# EAGLE design project_digisim_01 (EAGLE 9.6.2)

## Sheet 1 of 2
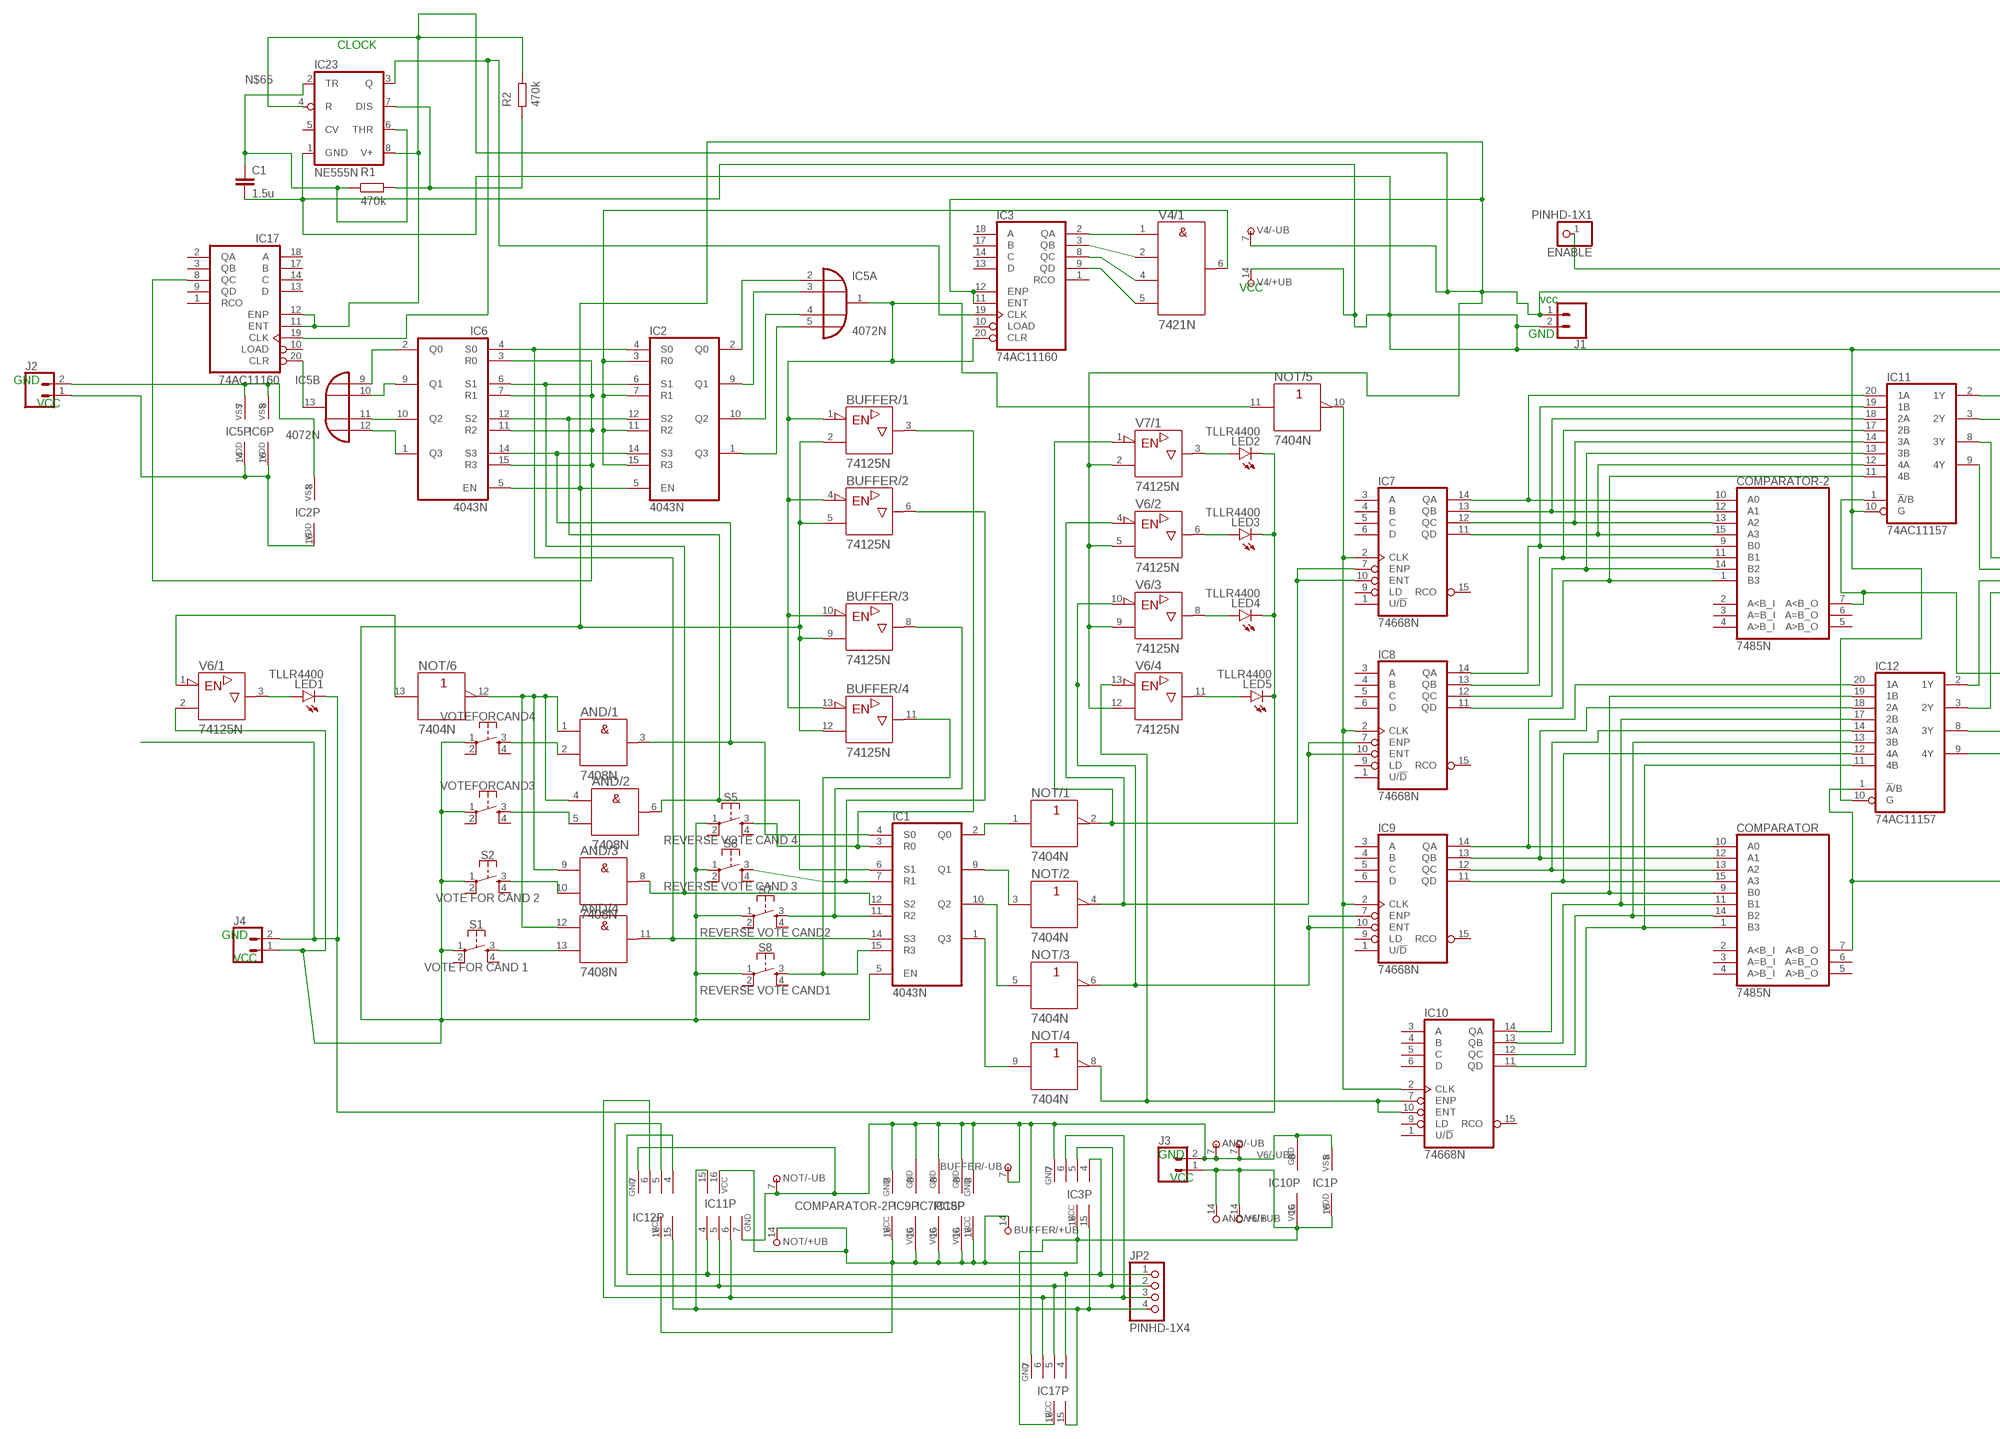
[diagram p0: schematic, sheet 1, part 1 of 2]
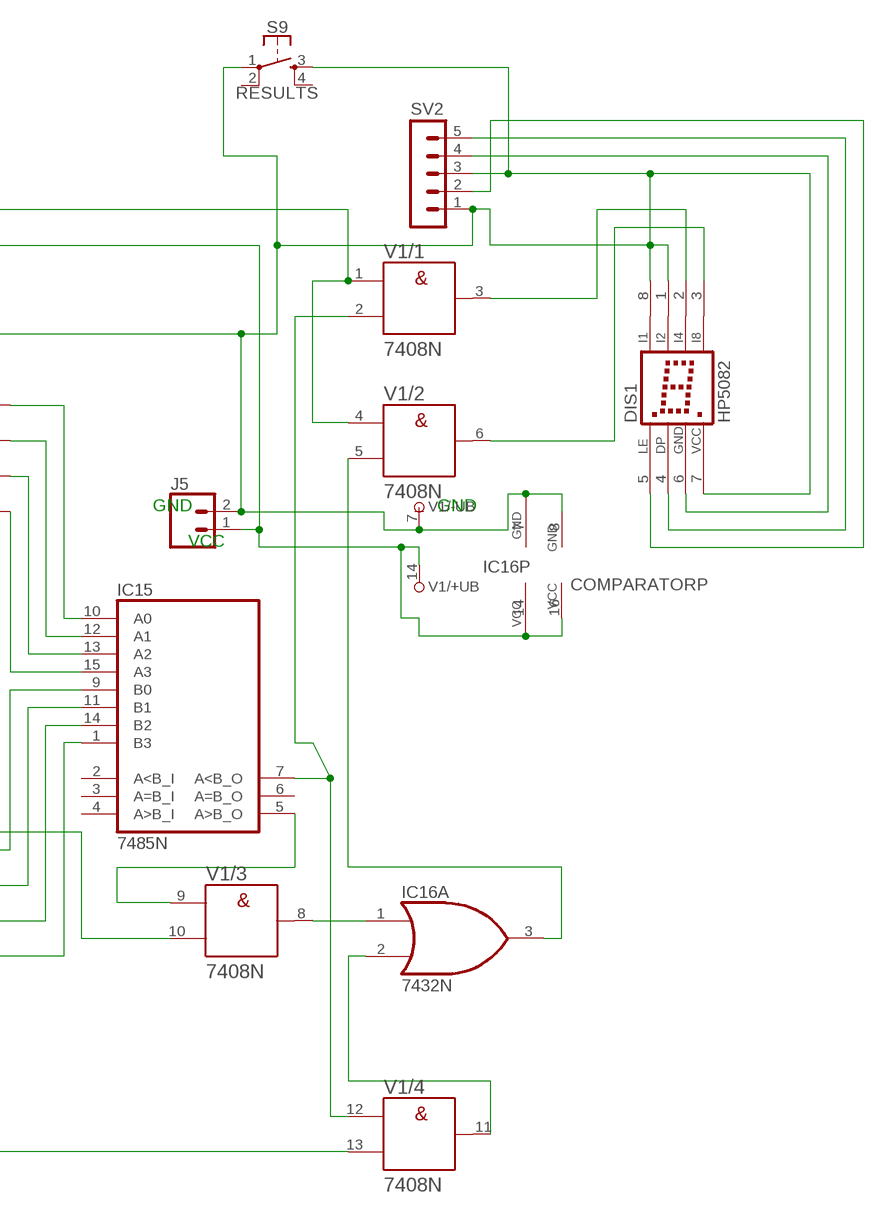
[diagram p1: schematic, sheet 1, part 2 of 2]

### Parts
AND  7408N  [DIL14]
BUFFER  74125N  [DIL14]
C1  1.5u  C2,5-3  [C2.5-3]
COMPARATOR  7485N  [DIL16]
COMPARATOR-2  7485N  [DIL16]
DIS1  HP5082  [HP5082]
ENABLE  PINHD-1X1  [1X01]
IC1  4043N  [DIL16]
IC2  4043N  [DIL16]
IC3  74AC11160  [DIL20]
IC5  4072N  [DIL14]
IC6  4043N  [DIL16]
IC7  74668N  [DIL16]
IC8  74668N  [DIL16]
IC9  74668N  [DIL16]
IC10  74668N  [DIL16]
IC11  74AC11157  [DIL20]
IC12  74AC11157  [DIL20]
IC15  7485N  [DIL16]
IC16  7432N  [DIL14]
IC17  74AC11160  [DIL20]
IC23  NE555N  [DIL08]
J1  CONN_02LOCK  [1X02_LOCK]
J2  CONN_02LOCK  [1X02_LOCK]
J3  CONN_02LOCK  [1X02_LOCK]
J4  CONN_02LOCK  [1X02_LOCK]
J5  CONN_02LOCK  [1X02_LOCK]
JP2  PINHD-1X4  [1X04]
LED1  TLLR4400  [LED3MM]
LED2  TLLR4400  [LED3MM]
LED3  TLLR4400  [LED3MM]
LED4  TLLR4400  [LED3MM]
LED5  TLLR4400  [LED3MM]
NOT  7404N  [DIL14]
R1  470k  R  (no package)
R2  470k  R  (no package)
S1  VOTE FOR CAND 1  MOMENTARY-SWITCH-SPST-2-SMD-4.6X2.8MM  [TACTILE_SWITCH_SMD_4.6X2.8MM]
S2  VOTE FOR CAND 2  MOMENTARY-SWITCH-SPST-2-SMD-4.6X2.8MM  [TACTILE_SWITCH_SMD_4.6X2.8MM]
S5  REVERSE VOTE CAND 4  MOMENTARY-SWITCH-SPST-2-SMD-4.6X2.8MM  [TACTILE_SWITCH_SMD_4.6X2.8MM]
S6  REVERSE VOTE CAND 3  MOMENTARY-SWITCH-SPST-2-SMD-4.6X2.8MM  [TACTILE_SWITCH_SMD_4.6X2.8MM]
S7  REVERSE VOTE CAND2  MOMENTARY-SWITCH-SPST-2-SMD-4.6X2.8MM  [TACTILE_SWITCH_SMD_4.6X2.8MM]
S8  REVERSE VOTE CAND1  MOMENTARY-SWITCH-SPST-2-SMD-4.6X2.8MM  [TACTILE_SWITCH_SMD_4.6X2.8MM]
S9  RESULTS  MOMENTARY-SWITCH-SPST-2-SMD-4.6X2.8MM  [TACTILE_SWITCH_SMD_4.6X2.8MM]
SV2  MA05-1  [MA05-1]
V1  7408N  [DIL14]
V4  7421N  [DIL14]
V6  74125N  [DIL14]
V7  74125N  [DIL14]
VOTEFORCAND3  MOMENTARY-SWITCH-SPST-2-SMD-4.6X2.8MM  [TACTILE_SWITCH_SMD_4.6X2.8MM]
VOTEFORCAND4  MOMENTARY-SWITCH-SPST-2-SMD-4.6X2.8MM  [TACTILE_SWITCH_SMD_4.6X2.8MM]

### Nets
N$1: AND.3(/1:Y) IC1.4(S0) IC2.14(S3) IC6.14(S3)
N$2: IC10.7(ENP) IC10.10(ENT) NOT.8(/4:Y) V6.13(/4:!G)
N$3: IC2.2(Q0) IC5.2(A:I0)
N$4: AND.8(/3:Y) IC1.12(S2) IC2.6(S1) IC6.6(S1)
N$5: DIS1.3(I8) V1.6(/2:Y)
N$6: BUFFER.3(/1:Y) IC1.3(R0) S5.3
N$7: BUFFER.6(/2:Y) IC1.7(R1) S6.3
N$8: BUFFER.11(/4:Y) IC1.15(R3) S8.3
N$9: IC1.2(Q0) NOT.1(/1:A)
N$10: IC1.9(Q1) NOT.3(/2:A)
N$11: NOT.13(/6:A) V6.1(/1:!G)
N$12: IC1.10(Q2) NOT.5(/3:A)
N$13: LED2.A V7.3(/1:Y)
N$14: IC1.1(Q3) NOT.9(/4:A)
N$15: LED3.A V6.6(/2:Y)
N$16: IC7.7(ENP) IC7.10(ENT) NOT.2(/1:Y) V7.1(/1:!G)
N$17: IC16.1(A:I0) V1.8(/3:Y)
N$18: IC2.8(VSS) IC5.7(P:VSS) IC6.8(VSS) J2.2
N$19: COMPARATOR-2.10(A0) IC7.14(QA) IC11.20(1A)
N$20: COMPARATOR-2.12(A1) IC7.13(QB) IC11.18(2A)
N$21: LED4.A V6.8(/3:Y)
N$22: COMPARATOR-2.13(A2) IC7.12(QC) IC11.14(3A)
N$23: COMPARATOR-2.15(A3) IC7.11(QD) IC11.12(4A)
N$24: COMPARATOR-2.9(B0) IC8.14(QA) IC11.19(1B)
N$25: COMPARATOR-2.11(B1) IC8.13(QB) IC11.17(2B)
N$26: COMPARATOR-2.14(B2) IC8.12(QC) IC11.13(3B)
N$27: COMPARATOR-2.1(B3) IC8.11(QD) IC11.11(4B)
N$28: COMPARATOR.10(A0) IC9.14(QA) IC12.20(1A)
N$29: COMPARATOR.12(A1) IC9.13(QB) IC12.18(2A)
N$30: COMPARATOR.13(A2) IC9.12(QC) IC12.14(3A)
N$31: COMPARATOR.15(A3) IC9.11(QD) IC12.12(4A)
N$32: COMPARATOR.9(B0) IC10.14(QA) IC12.19(1B)
N$33: COMPARATOR.11(B1) IC10.13(QB) IC12.17(2B)
N$34: COMPARATOR.14(B2) IC10.12(QC) IC12.13(3B)
N$35: COMPARATOR.1(B3) IC10.11(QD) IC12.11(4B)
N$36: IC11.2(1Y) IC15.10(A0)
N$37: IC11.3(2Y) IC15.12(A1)
N$38: IC11.8(3Y) IC15.13(A2)
N$39: IC11.9(4Y) IC15.15(A3)
N$40: IC12.2(1Y) IC15.9(B0)
N$41: IC12.3(2Y) IC15.11(B1)
N$42: IC12.8(3Y) IC15.14(B2)
N$43: IC12.9(4Y) IC15.1(B3)
N$44: COMPARATOR-2.7(A<B_O) IC11.1(!A!/B) V1.10(/3:B)
N$45: COMPARATOR.7(A<B_O) IC12.1(!A!/B) V1.13(/4:B)
N$46: AND.11(/4:Y) IC1.14(S3) IC2.4(S0) IC6.4(S0)
N$47: IC15.5(A>B_O) V1.9(/3:A)
N$48: ENABLE.1 V1.1(/1:A) V1.4(/2:A)
N$49: IC2.16(VDD) IC5.14(P:VDD) IC6.16(VDD) J2.1
N$50: IC16.2(A:I1) V1.11(/4:Y)
N$51: IC3.19(CLK) IC17.19(CLK) IC23.3(Q)
N$52: IC2.9(Q1) IC5.3(A:I1)
N$53: IC2.10(Q2) IC5.4(A:I2)
N$54: IC2.1(Q3) IC5.5(A:I3)
N$55: BUFFER.8(/3:Y) IC1.11(R2) S7.3
N$56: LED5.A V6.11(/4:Y)
N$57: IC16.3(A:O) V1.5(/2:B)
N$58: IC8.7(ENP) IC8.10(ENT) NOT.4(/2:Y) V6.4(/2:!G)
N$59: DIS1.2(I4) V1.3(/1:Y)
N$60: IC7.2(CLK) IC8.2(CLK) IC9.2(CLK) IC10.2(CLK) NOT.10(/5:Y)
N$61: J4.2 LED1.K(C) LED2.K(C) LED3.K(C) LED4.K(C) LED5.K(C)
N$62: IC15.7(A<B_O) V1.2(/1:B) V1.12(/4:A)
N$63: AND.6(/2:Y) IC1.6(S1) IC2.12(S2) IC6.12(S2)
N$64: LED1.A V6.3(/1:Y)
N$65: C1.1 IC23.2(TR) IC23.6(THR) R1.1
N$66: AND.2(/1:B) VOTEFORCAND4.3
N$67: AND.5(/2:B) VOTEFORCAND3.3
N$68: AND.10(/3:B) S2.3
N$69: AND.13(/4:B) S1.3
N$70: AND.1(/1:A) AND.4(/2:A) AND.9(/3:A) AND.12(/4:A) NOT.12(/6:Y)
N$71: IC3.2(QA) V4.1(/1:A)
N$72: IC3.3(QB) V4.2(/1:B)
N$73: IC3.8(QC) V4.4(/1:C)
N$74: IC3.9(QD) V4.5(/1:D)
N$75: IC2.3(R0) IC2.7(R1) IC2.11(R2) IC2.15(R3) V4.6(/1:Y)
N$76: IC23.7(DIS) R1.2 R2.1
N$77: IC5.13(B:O) IC17.20(CLR)
N$78: IC5.9(B:I0) IC6.2(Q0)
N$79: IC5.10(B:I1) IC6.9(Q1)
N$80: IC5.11(B:I2) IC6.10(Q2)
N$81: IC5.12(B:I3) IC6.1(Q3)
N$82: IC6.3(R0) IC6.7(R1) IC6.11(R2) IC6.15(R3) IC17.8(QC)
N$83: BUFFER.2(/1:A) BUFFER.5(/2:A) BUFFER.9(/3:A) BUFFER.12(/4:A) COMPARATOR.16(VCC) IC1.5(EN) IC2.5(EN) IC3.11(ENT) IC3.12(ENP) IC6.5(EN) IC16.14(P:VCC) IC17.11(ENT) IC17.12(ENP) IC23.4(R) IC23.8(V+) J1.1 J4.1 J5.1 R2.2 S1.1 S2.1 S5.1 S6.1 S7.1 S8.1 V1.14(/+UB:+UB) V4.7(/-UB:-UB) V6.2(/1:A) V6.5(/2:A) V6.9(/3:A) V6.12(/4:A) V7.2(/1:A) VOTEFORCAND3.1 VOTEFORCAND4.1
N$84: IC9.7(ENP) IC9.10(ENT) NOT.6(/3:Y) V6.10(/3:!G)
N$85: C1.2 COMPARATOR.8(GND) DIS1.1(I2) DIS1.7(VCC) DIS1.8(I1) IC11.10(G) IC12.10(G) IC16.7(P:GND) IC23.1(GND) J1.2 J5.2 S9.1 S9.3 SV2.1 SV2.3 V1.7(/-UB:-UB) V4.14(/+UB:+UB)
N$86: DIS1.6(GND) SV2.4
N$87: DIS1.4(DP) SV2.5
N$88: BUFFER.1(/1:!G) BUFFER.4(/2:!G) BUFFER.10(/3:!G) BUFFER.13(/4:!G) IC3.20(CLR) IC5.1(A:O) NOT.11(/5:A)
N$89: DIS1.5(LE) SV2.2
N$90: AND.7(/-UB:-UB) BUFFER.7(/-UB:-UB) COMPARATOR-2.8(GND) IC1.8(VSS) IC3.7(GND) IC7.8(GND) IC8.8(GND) IC9.8(GND) IC10.8(GND) IC11.7(GND) IC12.7(GND) IC15.8(GND) IC17.7(GND) J3.2 NOT.7(/-UB:-UB) V6.7(/-UB:-UB)
N$91: AND.14(/+UB:+UB) BUFFER.14(/+UB:+UB) COMPARATOR-2.16(VCC) IC1.16(VDD) IC3.16(VCC) IC7.16(VCC) IC8.16(VCC) IC9.16(VCC) IC10.16(VCC) IC11.16(VCC) IC12.16(VCC) IC15.16(VCC) IC17.16(VCC) J3.1 NOT.14(/+UB:+UB) V6.14(/+UB:+UB)
N$92: IC3.4(GND) IC11.4(GND) IC12.4(GND) IC17.4(GND) JP2.1
N$93: IC3.5(GND) IC11.5(GND) IC12.5(GND) IC17.5(GND) JP2.2
N$95: IC3.15(VCC) IC11.15(VCC) IC12.15(VCC) IC17.15(VCC) JP2.4
N$99: IC3.6(GND) IC11.6(GND) IC12.6(GND) IC17.6(GND) JP2.3
Unconnected: COMPARATOR-2.2(A<B_I) COMPARATOR-2.3(A=B_I) COMPARATOR-2.4(A>B_I) COMPARATOR-2.5(A>B_O) COMPARATOR-2.6(A=B_O) COMPARATOR.2(A<B_I) COMPARATOR.3(A=B_I) COMPARATOR.4(A>B_I) COMPARATOR.5(A>B_O) COMPARATOR.6(A=B_O) IC3.1(RCO) IC3.10(LOAD) IC3.13(D) IC3.14(C) IC3.17(B) IC3.18(A) IC7.1(U/!D) IC7.3(A) IC7.4(B) IC7.5(C) IC7.6(D) IC7.9(LD) IC7.15(RCO) IC8.1(U/!D) IC8.3(A) IC8.4(B) IC8.5(C) IC8.6(D) IC8.9(LD) IC8.15(RCO) IC9.1(U/!D) IC9.3(A) IC9.4(B) IC9.5(C) IC9.6(D) IC9.9(LD) IC9.15(RCO) IC10.1(U/!D) IC10.3(A) IC10.4(B) IC10.5(C) IC10.6(D) IC10.9(LD) IC10.15(RCO) IC15.2(A<B_I) IC15.3(A=B_I) IC15.4(A>B_I) IC15.6(A=B_O) IC16.4(B:I0) IC16.5(B:I1) IC16.6(B:O) IC16.8(C:O) IC16.9(C:I0) IC16.10(C:I1) IC16.11(D:O) IC16.12(D:I0) IC16.13(D:I1) IC17.1(RCO) IC17.2(QA) IC17.3(QB) IC17.9(QD) IC17.10(LOAD) IC17.13(D) IC17.14(C) IC17.17(B) IC17.18(A) IC23.5(CV) S1.2 S1.4 S2.2 S2.4 S5.2 S5.4 S6.2 S6.4 S7.2 S7.4 S8.2 S8.4 S9.2 S9.4 V4.8(/2:Y) V4.9(/2:A) V4.10(/2:B) V4.12(/2:C) V4.13(/2:D) V7.4(/2:!G) V7.5(/2:A) V7.6(/2:Y) V7.8(/3:Y) V7.9(/3:A) V7.10(/3:!G) V7.11(/4:Y) V7.12(/4:A) V7.13(/4:!G) VOTEFORCAND3.2 VOTEFORCAND3.4 VOTEFORCAND4.2 VOTEFORCAND4.4

### Notes on the sheet
- CLOCK
- VCC
- vcc
- GND
- GND
- VCC
- GND | GND
- VCC
- GND
- VCC
- GND
- VCC

## Sheet 2 of 2

## Power pins joined to a net without a drawn wire
+UB: V7.14(/+UB:+UB)
-UB: V7.7(/-UB:-UB)

## Library data of the parts
AND V1 = 74ttl-din:74*08: Quad 2-input AND gate
BUFFER V6 V7 = 74ttl-din:74*125: Quad bus BUFFER, 3-state
C1 = capacitor-wima:C: CAPACITOR naming: grid - package width
COMPARATOR COMPARATOR-2 IC15 = 74xx-eu:74*85: 4-bit magnitude COMPARATOR
DIS1 = display-hp:HP5082: LED DISPLAY 1-character dot matrix, 2 decimal points; OC_FARNELL: unknown; OC_NEWARK: unknown
ENABLE = Connector:PINHD-1X1: PIN HEADER; CATEGORY: CONNECTOR; SUB-CATEGORY: PIN-HEADER
IC1 IC2 IC6 = 40xx:4043: Quad 3-state NOR R/S LATCH
IC3 IC17 = 74ac-logic:74AC11160: Synchronous 4-bit decade Counter
IC5 = 40xx:4072: Dual 4-input OR
IC7-IC10 = 74xx-us:74*668: 4-bit synchronous decade COUNTER, preset
IC11 IC12 = 74ac-logic:74AC11157: Quadruple 2 to 1 line DATA SELECTOR/MULTIPLEXER
IC16 = 74xx-us:74*32: Quad 2-input OR gate
IC23 = linear:*555: TIMER
J1-J5 = SparkFun-Connectors:CONN_02: Multi connection point. Often used as Generic Header-pin footprint for 0.1 inch spaced/style header connections On any of the 0.1 inch spaced packages, you can populate with these: Break Away Headers - Straight <https://www.sparkfun.com/products/116> (PRT-00116) Break Away Male Headers - Right Angle <https://www.sparkfun.com/products/553> (PRT-00553) Female Headers <https://www.sparkfun.com/products/115> (PRT-00115) Break Away Headers - Machine Pin <https://www.sparkfun.com/products/117> (PRT-00117) Break Away Female Headers - Swiss Machine Pin <https://www.sparkfun.com/products/743> (PRT-00743) For SCREWTERMINALS and SPRING TERMINALS visit here: Screw Terimnals on SparkFun.com <https://www.sparkfun.com/search/results?term=Screw+Terminals> (5mm/3.5mm/2.54mm spacing) This device is also useful as a general connection point to wire up your design to another part of your project. Our various solder wires solder well into these plated through hole pads. Hook-Up Wire - Assortment (Stranded, 22 AWG) <https://www.sparkfun.com/products/11375> (PRT-11375) Hook-Up Wire - Assortment (Solid Core, 22 AWG) <https://www.sparkfun.com/products/11367> (PRT-11367) View the entire wire category on our website here <https://www.sparkfun.com/categories/141> Special notes: Molex polarized connector foot print use with: PRT-08233 with associated crimp pins and housings. 2.54_SCREWTERM for use with PRT-10571. 3.5mm Screw Terminal footprints for PRT-08084 5mm Screw Terminal footprints for use with PRT-08432
JP2 = Connector:PINHD-1X4: PIN HEADER; CATEGORY: CONNECTOR; SUB-CATEGORY: PIN-HEADER
LED1-LED5 = led:TLLR4400: Low Current (2mA) LED 3 mm Tinted Diffused Package color RED Source: Data sheet <http://www.farnell.com/datasheets/391100.pdf>; MF: VISHAY SEMICONDUCTOR; OC_FARNELL: 1612437
NOT = 74ttl-din:74*04: Hex INVERTER
R1 R2 = ngspice-simulation:R: RESISTOR
S1 S2 S5-S9 VOTEFORCAND3 VOTEFORCAND4 = SparkFun-Switches:MOMENTARY-SWITCH-SPST-2: Momentary Switch (Pushbutton) - SPST - Two Circuits Normally-open (NO) SPST momentary switches (buttons, pushbuttons). Schematic symbol includes two switch circuits. Variants SMD-4.6MMX2.8MM - 4.60mm x 2.80mm Tactile Momentary Button Switch - Used on SparkFun SAMD21 Mini Breakout <https://www.sparkfun.com/products/13664> SMD-5.2MM - Mini Pushbutton Switch - SMD <https://www.sparkfun.com/products/8720> - Used on Arduino Pro Mini <https://www.sparkfun.com/products/11114>; PROD_ID: SWCH-13065
SV2 = con-lstb:MA05-1: PIN HEADER; OC_FARNELL: unknown; OC_NEWARK: unknown
V4 = 74ttl-din:74*21: Dual 4-input AND gate

## Board
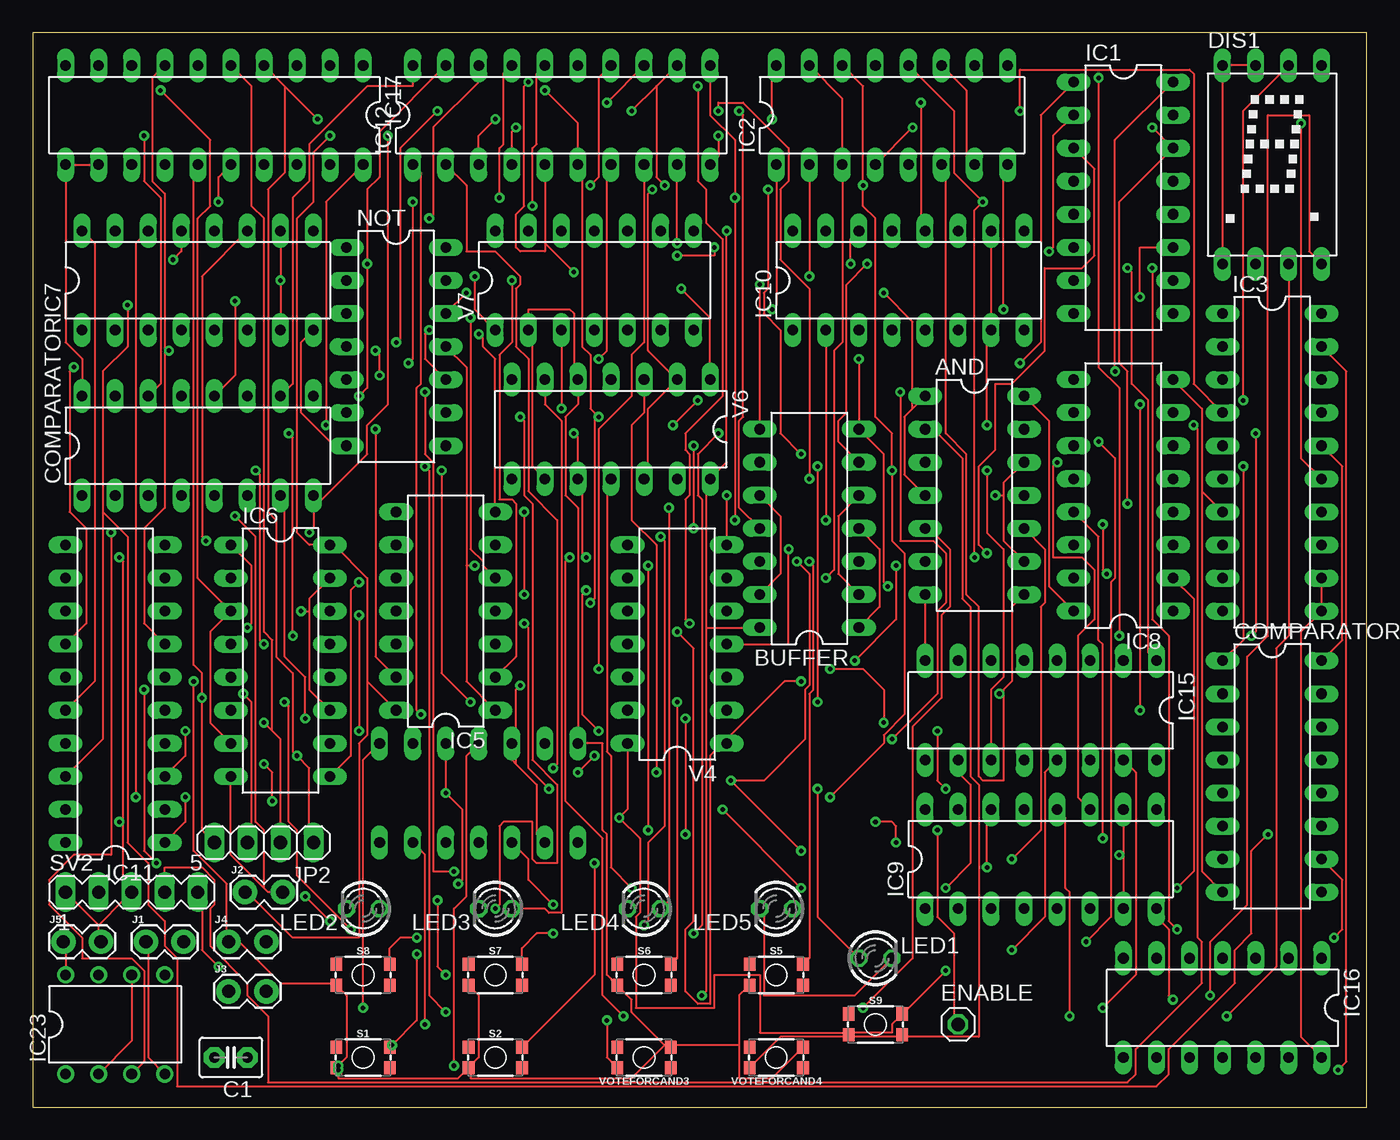
[diagram p2: board, top side]
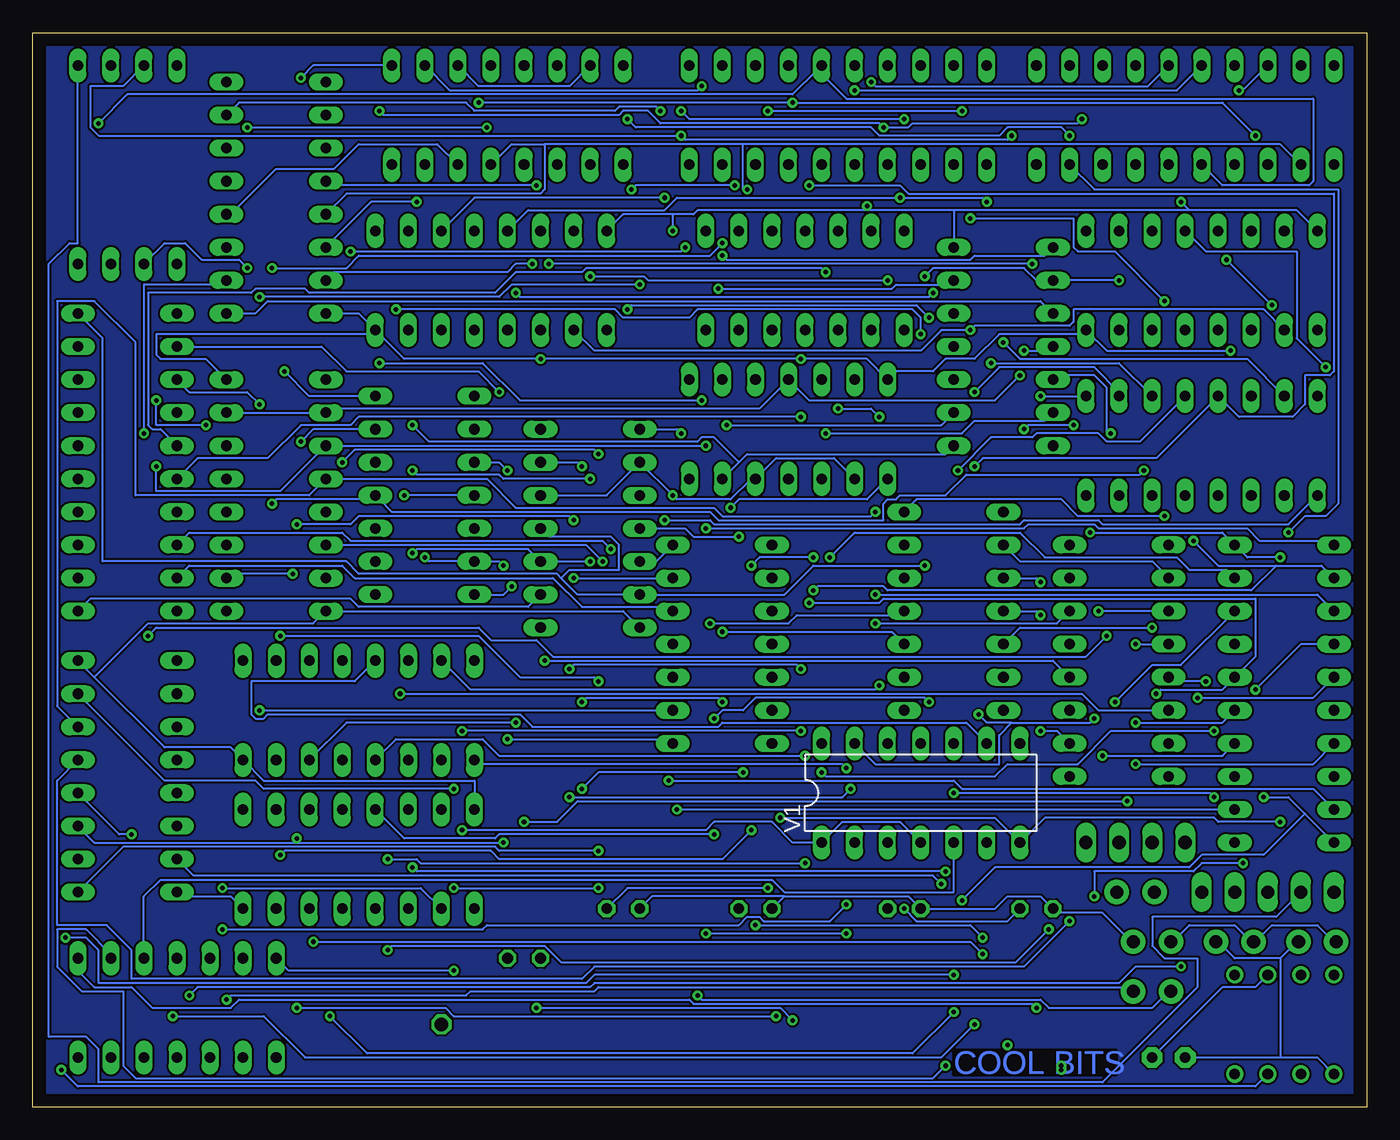
[diagram p3: board, bottom side, seen from below]

Size 102.54 x 82.54 mm. Coordinates in mm from the lower left corner, seen from the top.
Outline: 0,0 102.54,0 102.54,82.54 0,82.54 0,0
Copper layers (1*16): Top 0.035mm / dielectric 1.5mm / Bottom 0.035mm
Design rules "default": minimum track width 6mil, minimum drill 0.35mm, track to track 6mil, track to pad 6mil, pad to pad 6mil, via to via 6mil, smd to smd 6mil, copper to edge 40mil, drill to drill 6mil, minimum pad ring 10mil, minimum via ring 8mil, stop-mask expansion 4mil, vias tented up to drill 0mil, thermal gap 10mil

### Footprints (pad centres in the part's own frame; a part is rotated, then mirrored left to right if it is on the bottom)
DIL14 = drill 0.813 long: 1 -7.62,-3.81; 2 -5.08,-3.81; 3 -2.54,-3.81; 4 0,-3.81; 5 2.54,-3.81; 6 5.08,-3.81; 7 7.62,-3.81; 8 7.62,3.81; 9 5.08,3.81; 10 2.54,3.81; 11 0,3.81; 12 -2.54,3.81; 13 -5.08,3.81; 14 -7.62,3.81
C2.5-3 = drill 0.813 pad 1.6 octagon: 1 -1.27,0; 2 1.27,0
DIL16 = drill 0.813 long: 1 -8.89,-3.81; 2 -6.35,-3.81; 3 -3.81,-3.81; 4 -1.27,-3.81; 5 1.27,-3.81; 6 3.81,-3.81; 7 6.35,-3.81; 8 8.89,-3.81; 9 8.89,3.81; 10 6.35,3.81; 11 3.81,3.81; 12 1.27,3.81; 13 -1.27,3.81; 14 -3.81,3.81; 15 -6.35,3.81; 16 -8.89,3.81
HP5082 = drill 0.813 long: 1 -3.81,-7.62; 2 -1.27,-7.62; 3 1.27,-7.62; 4 3.81,-7.62; 5 3.81,7.62; 6 1.27,7.62; 7 -1.27,7.62; 8 -3.81,7.62
1X01 = drill 1.016 octagon: 1 0,0
DIL20 = drill 0.813 long: 1 -11.43,-3.81; 2 -8.89,-3.81; 3 -6.35,-3.81; 4 -3.81,-3.81; 5 -1.27,-3.81; 6 1.27,-3.81; 7 3.81,-3.81; 8 6.35,-3.81; 9 8.89,-3.81; 10 11.43,-3.81; 11 11.43,3.81; 12 8.89,3.81; 13 6.35,3.81; 14 3.81,3.81; 15 1.27,3.81; 16 -1.27,3.81; 17 -3.81,3.81; 18 -6.35,3.81; 19 -8.89,3.81; 20 -11.43,3.81
DIL08 = drill 0.813 pad 1.27: 1 -3.81,-3.81; 2 -1.27,-3.81; 3 1.27,-3.81; 4 3.81,-3.81; 5 3.81,3.81; 6 1.27,3.81; 7 -1.27,3.81; 8 -3.81,3.81
1X02_LOCK = drill 1.016 pad 1.88: 1 -0.178,0; 2 2.718,0
1X04 = drill 1.016 long: 1 -3.81,0; 2 -1.27,0; 3 1.27,0; 4 3.81,0
LED3MM = drill 0.813 octagon: A -1.27,0; K 1.27,0
TACTILE_SWITCH_SMD_4.6X2.8MM = smd 0.9 x 1: 1 -2.05,-0.8; 2 2.05,-0.8; 3 2.05,0.8; 4 -2.05,0.8
MA05-1 = drill 1.016 long: 1 -5.08,0; 2 -2.54,0; 3 0,0; 4 2.54,0; 5 5.08,0

### Placement (x,y rotation side)
AND  72.39,46.99 270 top
BUFFER  59.69,44.45 90 top
C1  15.24,3.81 180 top
COMPARATOR  12.7,50.8 0 top
COMPARATOR-2  95.25,25.4 270 top
DIS1  95.25,72.39 0 top
ENABLE  71.12,6.35 0 top
IC1  83.82,69.85 270 top
IC2  66.04,76.2 0 top
IC3  95.25,49.53 270 top
IC5  31.75,38.1 90 top
IC6  19.05,34.29 270 top
IC7  12.7,63.5 0 top
IC8  83.82,46.99 90 top
IC9  77.47,19.05 0 top
IC10  67.31,63.5 0 top
IC11  6.35,31.75 90 top
IC12  40.64,76.2 0 top
IC15  77.47,30.48 180 top
IC16  91.44,7.62 180 top
IC17  13.97,76.2 180 top
IC23  6.35,6.35 0 top
J1  8.89,12.7 0 top
J2  16.51,16.51 0 top
J3  15.24,8.89 0 top
J4  15.24,12.7 0 top
J5  2.54,12.7 0 top
JP2  17.78,20.32 180 top
LED1  64.77,11.43 0 top
LED2  25.4,15.24 180 top
LED3  35.56,15.24 180 top
LED4  46.99,15.24 180 top
LED5  57.15,15.24 180 top
NOT  27.94,58.42 270 top
S1  25.4,3.81 0 top
S2  35.56,3.81 0 top
S5  57.15,10.16 0 top
S6  46.99,10.16 0 top
S7  35.56,10.16 0 top
S8  25.4,10.16 0 top
S9  64.77,6.35 0 top
SV2  7.62,16.51 0 top
V1  34.29,24.13 0 bottom
V4  49.53,35.56 90 top
V6  44.45,52.07 180 top
V7  43.18,63.5 0 top
VOTEFORCAND3  46.99,3.81 180 top
VOTEFORCAND4  57.15,3.81 180 top

### Tracks (layer width: path | path; a pad name or v marks a point on that pad's centre or on a via)
GND
  pour Bottom: 0,82.55 102.87,82.55 102.87,0 0,0
N$1  (via drill 0.35)
  Top 0.152: v37.78,37.15 38.1,36.83 38.1,26.04 v39.69,24.45 | v61.28,23.81 65.41,27.94 65.41,28.57 66.99,30.16 66.99,42.55 66.04,43.5 v66.04,48.9 66.04,51.75 64.77,53.02 64.77,68.26 63.82,69.22 v63.82,70.8 63.82,78.42 IC2.14
  Bottom 0.152: IC6.14 23.81,37.15 v37.78,37.15 | v39.69,24.45 40.32,23.81 v61.28,23.81 | v66.04,48.9 66.67,49.53 AND.3 | IC1.4 79.69,70.8 v63.82,70.8
N$2  (via drill 0.35)
  Top 0.152: IC10.10 IC10.7 73.34,59.37 v73.34,52.39
  Bottom 0.152: NOT.8 32.38,50.16 47.62,50.16 48.26,49.53 | V6.13 48.26,49.53 | v73.34,52.39 72.07,51.12 51.44,51.12 51.12,51.44 50.16,51.44 48.26,49.53
N$3  (via drill 0.35)
  Top 0.152: IC5.2 37.15,34.61 37.15,46.35 36.83,46.67 35.88,46.67 35.88,57.78 36.83,58.74 v36.83,63.5 | IC2.2 v59.69,63.82
  Bottom 0.152: v36.83,63.5 55.24,63.5 55.56,63.82 v59.69,63.82
N$4  (via drill 0.35)
  Top 0.152: 74.61,32.07 75.25,32.7 75.25,38.42 AND.8 | 74.61,32.07 v74.3,31.75 | IC2.6 70.17,72.07 70.17,51.75 71.75,50.16 71.75,39.37 72.71,38.42 72.71,25.4 73.03,25.08 74.61,25.08 74.61,32.07
  Bottom 0.152: IC2.6 71.44,73.98 77.47,73.98 79.38,72.07 83.82,72.07 87.31,68.58 IC1.12 | IC6.6 20.64,30.48 21.91,31.75 v74.3,31.75
N$5  (via drill 0.35)
  Top 0.152: V1.6 30.16,19.37 v30.16,6.35 | v91.76,6.99 95.57,10.79 95.57,35.24 96.52,36.2 DIS1.3
  Bottom 0.152: v30.16,6.35 32.7,3.81 81.6,3.81 84.77,6.99 v91.76,6.99
N$6  (via drill 0.35)
  Top 0.152: v59.69,41.91 60.01,41.59 60.01,32.07 59.69,31.75 59.69,11.43 59.37,11.11 S5.3 | IC1.3 81.6,72.07 81.6,65.41 80.64,64.45 77.79,64.45 77.79,58.1 75.25,55.56 73.98,55.56 73.98,50.48 72.71,49.21 72.71,43.18 v73.34,42.55
  Bottom 0.152: v59.69,41.91 BUFFER.3 64.45,42.86 73.03,42.86 v73.34,42.55
N$7  (via drill 0.35)
  Top 0.152: v49.53,31.11 49.53,11.43 49.21,11.11 S6.3 | v60.33,49.21 v60.33,31.11 | v64.14,64.77 62.55,63.18 62.55,53.34 61.91,52.7 61.91,51.12 BUFFER.6
  Bottom 0.152: v49.53,31.11 49.85,31.43 60.01,31.43 v60.33,31.11 | v60.33,49.21 60.64,49.53 BUFFER.6 | IC1.7 79.38,64.14 66.04,64.14 65.41,64.77 v64.14,64.77
N$8  (via drill 0.35)
  Top 0.152: v29.53,13.02 28.26,13.02 27.45,12.21 S8.3 | v46.99,13.97 47.31,14.29 47.31,20.32 48.58,21.59 48.58,43.5 v48.26,43.81 | v54.29,76.52 54.61,76.2 54.61,53.02 54.29,52.7 54.29,46.04 BUFFER.11
  Bottom 0.152: v29.53,13.02 30.48,13.97 v46.99,13.97 | v48.26,43.81 51.75,43.81 52.39,44.45 BUFFER.11 | IC1.15 86.68,77.15 69.22,77.15 68.58,76.52 57.78,76.52 57.47,76.83 54.61,76.83 v54.29,76.52
N$9  (via drill 0.35)
  Top 0.152: v49.53,65.41 52.39,65.41 v52.39,66.04 | v78.11,65.72 78.42,66.04 78.42,74.61 IC1.2
  Bottom 0.152: NOT.1 24.77,65.41 30.16,65.41 30.48,65.09 49.21,65.09 v49.53,65.41 | v52.39,66.04 52.7,65.72 v78.11,65.72
N$10
  Bottom 0.152: NOT.3 25.08,61.91 84.45,61.91 85.41,60.96 IC1.9
N$11  (via drill 0.35)
  Top 0.152: v49.85,62.87 52.07,60.64 V6.1
  Bottom 0.152: NOT.13 32.07,63.18 36.2,63.18 36.51,62.87 v49.85,62.87
N$12  (via drill 0.35)
  Top 0.152: v19.68,51.75 20,51.44 v20,36.2 | v93.66,36.2 93.98,36.51 v93.98,51.75
  Bottom 0.152: NOT.5 23.81,56.2 20.95,56.2 20,55.24 20,51.75 v19.68,51.75 | v20,36.2 21.59,34.61 62.55,34.61 63.82,35.88 67.31,35.88 68.26,36.83 93.03,36.83 v93.66,36.2 | v93.98,51.75 93.98,63.18 87.95,63.18 IC1.10
N$13  (via drill 0.35)
  Top 0.152: v35.56,15.24 35.88,15.56 35.88,21.59 36.2,21.91 38.42,21.91 38.42,19.05 38.73,18.73 40.32,18.73 40.32,24.77 38.42,26.67 38.42,46.35 37.78,46.99 37.78,52.7 v37.47,53.02 | V7.3 v40.64,53.66
  Bottom 0.152: LED2.A 27.62,14.29 34.61,14.29 v35.56,15.24 | v37.47,53.02 38.1,53.66 v40.64,53.66
N$14  (via drill 0.35)
  Top 0.152: v51.12,54.29 v49.21,52.39 | v75.88,57.15 77.47,58.74 77.47,76.2 IC1.1
  Bottom 0.152: NOT.9 32.7,52.39 v49.21,52.39 | v51.12,54.29 65.09,54.29 67.94,57.15 v75.88,57.15
N$15
  Top 0.152: LED3.A 39.37,15.24 39.69,14.92 40.64,14.92 40.64,52.7 39.37,53.98 V6.6
N$16  (via drill 0.35)
  Top 0.152: IC7.10 v19.05,63.5 IC7.7 | V7.1 33.97,61.28 v33.97,63.82
  Bottom 0.152: v19.05,63.5 NOT.2 25.4,63.5 26.35,64.45 33.34,64.45 v33.97,63.82
N$17  (via drill 0.35)
  Top 0.152: V1.8 25.4,26.67 v25.4,7.62
  Bottom 0.152: v25.4,7.62 25.72,7.94 51.75,7.94 52.07,8.26 86.68,8.26 87.31,7.62 93.34,7.62 94.93,9.21 97.79,9.21 99.06,10.48 IC16.1
N$18  (via drill 0.35)
  Top 0.152: IC6.8 15.24,19.37 17.78,16.83 | 17.78,16.83 18.1,16.51 J2.2 | v15.56,45.4 17.14,43.81 17.14,21.91 17.78,21.27 17.78,16.83 | IC2.8 74.61,72.07 v74.61,61.28 | v34.29,59.37 34.61,59.05 34.61,58.42 35.56,57.47 IC5.7
  Bottom 0.152: IC5.7 34.61,46.67 23.5,46.67 22.23,45.4 v15.56,45.4 | v74.61,61.28 57.78,61.28 57.15,60.64 52.07,60.64 51.44,61.28 34.92,61.28 34.29,60.64 v34.29,59.37
N$19  (via drill 0.35)
  Top 0.152: v7.94,23.81 7.94,66.36 IC7.14 | COMPARATOR-2.10 100.65,17.46 100.65,13.65 v100.01,13.02 | v31.75,10.16 31.11,10.79 v31.11,15.88
  Bottom 0.152: 4.76,22.54 6.03,23.81 v7.94,23.81 | 4.76,22.54 IC11.20 | v100.01,13.02 98.42,13.02 97.47,12.06 97.47,9.53 60.01,9.53 59.37,10.16 v31.75,10.16 | v31.11,15.88 28.57,18.41 13.65,18.41 12.7,19.37 7.94,19.37 4.76,22.54
N$20  (via drill 0.35)
  Top 0.152: IC11.18 5.4,28.26 5.4,45.72 | 5.4,45.72 5.4,56.52 7.3,58.42 v7.3,61.59 | v10.79,65.09 11.43,65.72 IC7.13 | v94.93,20.95 93.66,19.68 93.66,13.34 92.39,12.06 92.39,9.53 87.31,4.45 87.31,2.54 86.36,1.59 11.11,1.59 11.11,11.43 10.16,12.38 10.16,14.29 8.89,15.56 8.89,18.73 7.3,20.32 7.3,43.81 5.4,45.72
  Bottom 0.152: v10.79,65.09 v7.3,61.59 | COMPARATOR-2.12 95.89,20.95 v94.93,20.95
N$21  (via drill 0.35)
  Top 0.152: LED4.A 48.9,15.88 v48.9,46.04
  Bottom 0.152: v48.9,46.04 48.26,46.67 38.42,46.67 V6.8
N$22  (via drill 0.35)
  Top 0.152: IC11.14 4.13,37.15 4.13,44.45 2.86,45.72 2.86,56.52 v3.17,56.83 | v20.95,16.19 v22.86,14.29 | v9.53,18.73 8.57,19.68 v8.57,32.07
  Bottom 0.152: v3.17,56.83 5.4,59.05 5.4,65.72 12.38,65.72 IC7.12 | COMPARATOR-2.13 100.65,25.08 100.65,13.97 96.84,13.97 94.93,12.06 94.93,9.84 60.33,9.84 59.37,10.79 26.35,10.79 v22.86,14.29 | v20.95,16.19 20.95,18.1 13.34,18.1 12.7,18.73 v9.53,18.73 | v8.57,32.07 5.08,35.56 IC11.14
N$23  (via drill 0.35)
  Top 0.152: v13.34,43.5 13.02,43.81 13.02,63.82 IC7.11 | v70.17,24.45 69.53,25.08 v69.53,28.89 | v43.5,28.89 42.23,30.16 42.23,39.37 v42.55,39.69
  Bottom 0.152: IC11.12 3.49,41.59 6.99,41.59 | 6.99,41.59 11.43,41.59 v13.34,43.5 | COMPARATOR-2.15 92.39,25.08 85.41,25.08 84.77,24.45 v70.17,24.45 | v43.5,28.89 v69.53,28.89 | v42.55,39.69 42.23,40.01 37.15,40.01 36.83,39.69 8.89,39.69 6.99,41.59
N$24  (via drill 0.35)
  Top 0.152: v58.74,41.91 59.69,40.96 59.69,32.38 59.37,32.07 59.37,28.26 56.2,25.08 v53.66,25.08 v59.05,19.68
  Bottom 0.152: IC11.19 4.13,24.45 31.11,24.45 31.75,25.08 v53.66,25.08 | v58.74,41.91 60.01,43.18 IC8.14 | COMPARATOR-2.9 95.57,20 66.99,20 66.67,19.68 v59.05,19.68
N$25  (via drill 0.35)
  Top 0.152: v17.78,26.35 18.41,25.72 v18.41,23.5 | v66.36,20.32 66.36,21.59 66.04,21.91 v64.77,21.91 | IC8.13 81.92,43.81 81.92,35.88 82.23,35.56 v82.23,20.64
  Bottom 0.152: IC11.17 4.13,26.35 v17.78,26.35 | v18.41,23.5 60.64,23.5 62.23,21.91 v64.77,21.91 | 82.23,20.32 97.79,20.32 COMPARATOR-2.11 | 82.23,20.32 v66.36,20.32 | 82.23,20.32 v82.23,20.64
N$26  (via drill 0.35)
  Top 0.152: v37.78,45.72 v37.78,39.37
  Bottom 0.152: IC11.13 3.81,39.37 v37.78,39.37 | v37.78,45.72 38.1,45.4 49.53,45.4 50.16,46.04 65.41,46.04 67.63,48.26 IC8.12 81.28,46.99 94.61,46.99 94.61,58.74 97.79,61.91 100.65,61.91 100.65,30.8 COMPARATOR-2.14
N$27  (via drill 0.35)
  Top 0.152: v50.8,50.8 v50.8,44.45 | COMPARATOR-2.1 93.03,35.88 v93.03,49.21
  Bottom 0.152: IC11.11 2.86,43.5 8.26,43.5 9.21,44.45 20.64,44.45 20.95,44.77 26.04,44.77 26.35,44.45 v50.8,44.45 | v50.8,50.8 IC8.11 83.5,47.31 93.03,47.31 v93.03,49.21
N$28  (via drill 0.35)
  Top 0.152: COMPARATOR.10 20,55.56 20,69.85 21.27,71.12 21.27,73.98 25.72,78.42 29.21,78.42 IC12.20 | IC9.14 73.34,22.54 v73.34,18.41 | v32.38,18.1 30.8,18.1 30.8,49.53 30.16,50.16 v30.16,54.93
  Bottom 0.152: v73.34,18.41 73.03,18.1 v32.38,18.1 | v30.16,54.93 28.26,56.83 20.95,56.83 19.05,54.93 COMPARATOR.10
N$29  (via drill 0.35)
  Top 0.152: COMPARATOR.12 15.56,56.2 v15.56,61.91 | v30.48,68.26 30.8,68.58 30.8,75.25 34.29,78.74 IC12.18 | v50.16,29.84 v50.16,20.95 | v33.66,31.11 31.43,33.34 v31.43,48.9
  Bottom 0.152: v15.56,61.91 19.37,65.72 22.23,65.72 22.54,66.04 22.54,68.26 v30.48,68.26 | IC9.13 73.98,20.64 66.99,20.64 66.67,20.95 v50.16,20.95 | v50.16,29.84 49.53,30.48 47.94,30.48 46.99,31.43 33.97,31.43 v33.66,31.11 | v31.43,48.9 28.89,51.44 25.72,51.44 25.4,51.75 20.64,51.75 20,51.12 17.46,51.12 COMPARATOR.12
N$30  (via drill 0.35)
  Top 0.152: v42.86,70.8 43.5,71.44 43.5,79.06 IC12.14 | IC9.12 79.38,22.23 79.38,16.83 79.69,16.51 v79.69,6.99 | v31.75,7.3 30.48,8.57 30.48,48.9 v30.16,49.21
  Bottom 0.152: v42.86,70.8 35.88,70.8 35.24,70.17 2.54,70.17 2.54,56.52 2.86,56.2 4.76,56.2 4.76,53.98 5.71,53.02 9.84,53.02 COMPARATOR.13 16.19,49.85 29.53,49.85 v30.16,49.21 | v79.69,6.99 76.83,4.13 34.92,4.13 v31.75,7.3
N$31  (via drill 0.35)
  Top 0.152: v27.94,58.74 28.26,59.05 28.26,73.66 v31.11,76.52 | IC12.12 47.94,78.42 | 47.94,78.42 v46.04,76.52 | IC9.11 80.33,23.81 80.33,36.2 81.6,37.47 81.6,41.27 80.64,42.23 78.42,42.23 78.42,49.21 v78.74,49.53 | v59.05,50.16 57.47,51.75 57.47,59.69 56.2,60.96 56.2,62.55 56.52,62.87 v56.52,70.48 | v48.58,70.8 47.94,71.44 47.94,78.42
  Bottom 0.152: COMPARATOR.15 9.21,57.47 26.67,57.47 v27.94,58.74 | v46.04,76.52 v31.11,76.52 | v78.74,49.53 77.79,50.48 59.37,50.48 v59.05,50.16 | v56.52,70.48 56.2,70.8 v48.58,70.8
N$32  (via drill 0.35)
  Top 0.152: v25.08,54.61 25.72,55.24 v25.72,64.77 25.72,70.48 26.67,71.44 26.67,74.93 IC12.19 | IC10.14 62.87,66.67 v62.87,64.77
  Bottom 0.152: v25.08,54.61 COMPARATOR.9 | v25.72,64.77 v62.87,64.77
N$33  (via drill 0.35)
  Top 0.152: v28.89,57.15 29.21,57.47 v29.21,69.53 | IC12.17 36.2,79.38 36.2,73.98 35.88,73.66 v35.88,69.85
  Bottom 0.152: COMPARATOR.11 19.05,57.15 v28.89,57.15 | v29.21,69.53 29.53,69.85 v35.88,69.85 53.02,69.85 53.98,68.9 64.45,68.9 IC10.13
N$34  (via drill 0.35)
  Top 0.152: COMPARATOR.14 9.84,55.56 9.84,69.85 8.57,71.12 v8.57,74.61 | IC12.13 v44.13,77.15 | IC10.12 68.26,67.63 v68.26,77.15
  Bottom 0.152: v8.57,74.61 11.11,77.15 v44.13,77.15 v68.26,77.15
N$35  (via drill 0.35)
  Top 0.152: v53.98,45.09 v53.98,69.85 53.98,74.3 52.07,76.2 IC12.11
  Bottom 0.152: COMPARATOR.1 6.03,44.77 20.32,44.77 20.64,45.09 26.35,45.09 26.67,44.77 50.16,44.77 50.48,45.09 v53.98,45.09 | IC10.11 68.58,69.85 v53.98,69.85
N$36  (via drill 0.35)
  Top 0.152: v59.05,16.83 v53.02,22.86 | v70.17,16.83 72.07,18.73 72.07,24.77 71.12,25.72 IC15.10
  Bottom 0.152: v53.02,22.86 IC11.2 | v70.17,16.83 v59.05,16.83
N$37  (via drill 0.35)
  Top 0.152: IC11.3 11.75,26.99 v11.75,28.89 | v43.18,26.99 v41.91,25.72
  Bottom 0.152: v11.75,28.89 19.68,28.89 22.23,26.35 27.62,26.35 28.57,25.4 41.59,25.4 v41.91,25.72 | v43.18,26.99 66.67,26.99 67.94,28.26 74.61,28.26 IC15.12
N$38  (via drill 0.35)
  Top 0.152: v19.37,31.11 19.68,30.8 19.68,21.91 20.32,21.27 20.32,17.78 v24.45,13.65 | v75.25,12.06 77.79,14.61 77.79,25.72 IC15.13
  Bottom 0.152: IC11.8 14.29,33.97 16.51,33.97 v19.37,31.11 | v24.45,13.65 26.99,11.11 61.91,11.11 63.18,12.38 74.93,12.38 v75.25,12.06
N$39  (via drill 0.35)
  Top 0.152: v41.27,42.23 40.96,41.91 40.96,23.5 43.81,20.64 43.81,8.57 v45.4,6.99 | v82.23,7.62 84.77,10.16 84.77,25.72 IC15.15
  Bottom 0.152: IC11.9 10.79,41.27 13.65,41.27 14.61,42.23 24.77,42.23 26.67,44.13 39.37,44.13 v41.27,42.23 | v45.4,6.99 70.17,6.99 70.8,7.62 v82.23,7.62
N$40  (via drill 0.35)
  Top 0.152: v40.01,26.04 40.32,26.35 40.32,45.09 38.1,47.31 38.1,57.47 37.15,58.42 37.15,62.87 37.47,63.18 37.47,63.82 35.56,65.72 33.34,65.72 33.34,70.8 IC12.2
  Bottom 0.152: IC15.9 68.26,26.35 40.32,26.35 v40.01,26.04
N$41  (via drill 0.35)
  Top 0.152: IC15.11 73.66,32.07 74.61,33.02 74.61,42.86 73.34,44.13 v73.34,48.9 | v59.69,48.26 59.69,62.87 57.47,65.09 57.47,70.48 58.1,71.12 58.1,73.66 54.61,77.15 52.7,77.15 v52.7,76.52 | v35.56,75.88 34.29,74.61 IC12.3
  Bottom 0.152: v73.34,48.9 73.03,48.58 66.67,48.58 66.36,48.26 v59.69,48.26 | v52.7,76.52 52.07,75.88 v35.56,75.88
N$42  (via drill 0.35)
  Top 0.152: v61.28,33.66 63.82,33.66 65.41,32.07 v65.41,29.53 | v43.5,33.66 43.5,52.07 46.04,54.61 46.04,57.78 46.99,58.74 IC12.8
  Bottom 0.152: IC15.14 78.42,29.53 v65.41,29.53 | v61.28,33.66 60.96,33.97 43.81,33.97 v43.5,33.66
N$43  (via drill 0.35)
  Top 0.152: v49.53,66.36 IC12.9 | v84.14,64.45 84.45,64.14 84.45,55.56 85.72,54.29 85.72,34.92 IC15.1
  Bottom 0.152: v49.53,66.36 50.48,65.41 77.47,65.41 78.42,64.45 v84.14,64.45
N$44  (via drill 0.35)
  Top 0.152: IC11.1 11.75,21.91 v11.75,23.81 | V1.10 v31.75,24.13 33.02,22.86 33.02,17.46 v32.7,17.14
  Bottom 0.152: v11.75,23.81 12.06,24.13 v31.75,24.13 | COMPARATOR-2.7 90.17,17.78 33.34,17.78 v32.7,17.14
N$45  (via drill 0.35)
  Top 0.152: COMPARATOR.7 19.37,46.67 19.37,34.61 20.95,33.02 v20.95,29.84 | IC12.1 29.84,71.75 29.84,55.56 29.53,55.24 29.53,30.48 v29.84,30.16
  Bottom 0.152: v20.95,29.84 21.27,29.53 27.3,29.53 | 27.3,29.53 28.26,28.57 28.26,26.35 37.78,26.35 V1.13 | v29.84,30.16 29.21,29.53 27.3,29.53
N$46  (via drill 0.35)
  Top 0.152: v67.63,75.25 IC2.4 | v86.04,75.25 IC1.14 83.5,69.53 83.5,57.15 84.14,56.52 v84.14,46.35 | v17.78,35.56 17.46,35.88 17.46,48.58 v17.14,48.9
  Bottom 0.152: v86.04,75.25 v67.63,75.25 | v17.78,35.56 IC6.4 | v17.14,48.9 17.46,48.58 30.8,48.58 32.38,46.99 35.88,46.99 36.2,46.67 36.83,46.67 37.15,46.35 37.15,45.09 49.85,45.09 50.48,45.72 74.93,45.72 75.88,46.67 | v84.14,46.35 83.82,46.67 75.88,46.67 | 75.88,46.67 AND.11
N$47
  Bottom 0.152: V1.9 30.8,29.53 49.53,29.53 49.85,29.21 64.14,29.21 65.09,30.16 84.45,30.16 84.77,29.84 85.41,29.84 85.72,30.16 85.72,32.7 77.79,32.7 IC15.5
N$48  (via drill 0.35)
  Top 0.152: ENABLE.1 70.8,6.67 70.8,13.34 69.53,14.61 v69.53,21.27
  Bottom 0.152: V1.4 35.88,21.91 40.32,21.91 V1.1 44.13,20.32 45.72,21.91 50.16,21.91 50.8,21.27 v69.53,21.27
N$49  (via drill 0.35)
  Top 0.152: 25.72,32.7 IC5.14 | 25.72,32.7 25.72,40.64 23.18,43.18 IC6.16 21.27,43.18 20.32,44.13 20.32,68.26 21.59,69.53 21.59,73.34 v22.86,74.61 | IC2.16 56.83,79.69 v56.83,75.88 | 25.72,32.7 25.72,28.57 25.08,27.94 25.08,13.02 20,13.02 16.51,16.51 J2.1
  Bottom 0.152: v56.83,75.88 56.2,75.25 38.1,75.25 37.47,74.61 28.26,74.61 27.62,75.25 23.5,75.25 v22.86,74.61
N$50  (via drill 0.35)
  Top 0.152: V1.11 33.34,26.99 33.34,16.19 32.38,15.24 v32.38,3.17
  Bottom 0.152: v32.38,3.17 33.34,2.22 94.61,2.22 95.57,3.17 95.57,8.89 98.74,8.89 100.65,10.79 100.65,13.65 98.42,13.65 96.52,11.75 IC16.2
N$51  (via drill 0.35)
  Top 0.152: IC23.3 8.57,3.49 8.57,10.48 7.62,11.43 3.81,11.43 3.81,13.02 1.27,15.56 1.27,17.46 3.17,19.37 6.03,19.37 v6.03,44.13 | IC3.19 100.97,56.52 100.97,3.49 v100.33,2.86
  Bottom 0.152: v6.03,44.13 4.76,45.4 3.17,45.4 2.22,46.35 2.22,70.48 20.95,70.48 IC17.19 | v100.33,2.86 99.06,1.59 8.57,1.59 IC23.3
N$52  (via drill 0.35)
  Top 0.152: v49.53,36.51 50.8,35.24 50.8,14.29 50.16,13.65 50.16,8.89 51.12,7.94 52.07,7.94 52.07,26.99 57.78,32.7 v59.05,32.7 | v83.5,36.2 83.5,55.24 81.92,56.83 v81.92,79.06
  Bottom 0.152: IC5.3 36.51,36.51 v49.53,36.51 | v59.05,32.7 59.37,33.02 65.09,33.02 68.26,36.2 v83.5,36.2 | v81.92,79.06 80.96,80.01 IC2.9
N$53  (via drill 0.35)
  Top 0.152: v50.48,37.15 50.16,37.47 50.16,46.67 50.48,46.99 50.48,50.16 50.16,50.48 50.16,51.75 53.02,54.61 53.02,66.67 51.75,67.94 51.75,70.48 51.12,71.12 v51.12,78.42
  Bottom 0.152: IC5.4 35.88,37.78 43.81,37.78 44.45,37.15 v50.48,37.15 | v51.12,78.42 51.44,78.11 70.48,78.11 IC2.10
N$54  (via drill 0.35)
  Top 0.152: IC5.5 34.61,41.59 34.61,41.91 33.66,42.86 v33.66,60.64 | v56.83,61.28 57.15,61.59 IC2.1
  Bottom 0.152: v33.66,60.64 34.61,61.59 56.52,61.59 v56.83,61.28
N$55  (via drill 0.35)
  Top 0.152: v40.01,13.34 38.73,13.34 37.61,12.21 S7.3 | v50.8,13.34 51.44,13.97 51.44,46.67 51.12,46.99 51.12,50.16 v52.7,51.75 | IC1.11 85.09,66.04 v85.09,62.23 | BUFFER.8 v55.88,63.18
  Bottom 0.152: v50.8,13.34 v40.01,13.34 | v52.7,51.75 53.02,52.07 BUFFER.8 | v85.09,62.23 66.67,62.23 65.72,63.18 v55.88,63.18
N$56  (via drill 0.35)
  Top 0.152: v46.04,16.83 44.45,18.41 44.45,26.99 44.13,27.3 44.13,47.94 V6.11
  Bottom 0.152: LED5.A 56.83,16.83 v46.04,16.83
N$57
  Bottom 0.152: V1.5 31.75,16.51 44.77,16.51 45.72,17.46 92.71,17.46 93.98,16.19 IC16.3
N$58  (via drill 0.35)
  Top 0.152: v26.35,58.1 26.67,57.78 v26.67,56.2
  Bottom 0.152: IC8.7 IC8.10 79.69,53.66 46.67,53.66 V6.4 42.86,54.29 28.57,54.29 v26.67,56.2 | NOT.4 24.45,58.1 v26.35,58.1
N$59  (via drill 0.35)
  Top 0.152: V1.3 38.1,19.05 38.1,17.46 v40.01,15.56 | v87.95,13.65 87.31,14.29 87.31,36.2 86.04,37.47 v86.04,64.45
  Bottom 0.152: v40.01,15.56 41.27,14.29 46.35,14.29 46.67,14.61 47.62,14.61 48.26,13.97 67.63,13.97 67.94,13.65 v87.95,13.65 | v86.04,64.45 86.68,65.09 89.53,65.09 90.81,66.36 92.39,66.36 DIS1.2
N$60  (via drill 0.35)
  Top 0.152: v87.95,16.83 89.22,18.1 89.22,39.05 IC8.2 | NOT.10 30.16,57.47 30.16,59.37 v30.48,59.69 | v82.55,40.96 82.23,41.27 v82.23,44.77 | IC10.2 v60.96,45.09
  Bottom 0.152: IC9.2 72.71,16.83 v87.95,16.83 | IC7.2 7.94,61.28 22.54,61.28 22.54,60.33 22.86,60.01 30.16,60.01 v30.48,59.69 32.7,59.69 34.29,58.1 59.37,58.1 IC10.2 | IC8.2 87.31,40.96 v82.55,40.96 | v82.23,44.77 78.11,44.77 77.47,45.4 61.28,45.4 v60.96,45.09
N$61
  Top 0.152: LED1.K 63.18,8.57 56.2,8.57 56.2,14.92 LED5.K
  Bottom 0.152: J4.2 18.1,12.7 20.32,14.92 23.81,14.92 LED2.K 25.08,16.19 27.62,16.19 28.57,15.24 LED3.K 35.24,16.19 44.77,16.19 | LED4.K 44.77,16.19 | LED5.K 54.93,16.19 44.77,16.19
N$62  (via drill 0.35)
  Top 0.152: V1.2 38.73,20.95 38.73,24.77 37.15,26.35 | 37.15,26.35 36.83,26.67 V1.12 | v37.47,32.38 37.15,32.07 37.15,26.35
  Bottom 0.152: IC15.7 68.9,32.07 37.78,32.07 v37.47,32.38
N$63  (via drill 0.35)
  Top 0.152: IC2.12 70.8,76.52 70.8,71.75 v73.03,69.53 72.39,68.9 v72.39,42.23 | v63.18,34.29 66.36,37.47 v66.36,41.59
  Bottom 0.152: IC1.6 76.52,69.53 v73.03,69.53 | IC6.12 24.13,34.29 v63.18,34.29 | v66.36,41.59 66.67,41.91 AND.6 72.07,41.91 v72.39,42.23
N$64  (via drill 0.35)
  Top 0.152: LED1.A 60.33,14.61 v60.33,24.45 | v47.94,25.72 47.94,43.18 46.04,45.09 46.04,52.39 46.99,53.34 V6.3
  Bottom 0.152: v60.33,24.45 59.05,25.72 v47.94,25.72
N$65
  Top 0.152: IC23.2 7.62,5.08 IC23.6
  Bottom 0.152: C1.1 11.11,9.21 8.57,9.21 IC23.6
N$66
  Top 0.152: AND.2 69.22,52.07 71.44,49.85 71.44,39.05 72.07,38.42 72.07,25.4 72.71,24.77 72.71,5.4 57.47,5.4 55.24,3.17 VOTEFORCAND4.3
N$67  (via drill 0.35)
  Top 0.152: v44.13,6.67 44.13,3.81 44.77,3.17 VOTEFORCAND3.3 | v63.82,7.62 67.63,11.43 67.63,29.21 69.85,31.43 69.85,37.78 70.48,38.42 70.48,42.86 68.9,44.45 AND.5
  Bottom 0.152: v44.13,6.67 45.09,7.62 v63.82,7.62
N$68  (via drill 0.35)
  Top 0.152: v43.18,18.73 43.18,10.16 37.78,4.76 S2.3 | v75.25,19.05 77.47,21.27 77.47,38.42 77.79,38.73 77.79,42.86 AND.10
  Bottom 0.152: v43.18,18.73 72.71,18.73 73.03,19.05 v75.25,19.05
N$69  (via drill 0.35)
  Top 0.152: v29.53,11.75 29.53,6.67 v27.62,4.76 S1.3 | v80.96,12.7 82.87,14.61 82.87,40.32 83.19,40.64 83.19,49.85 v81.92,51.12
  Bottom 0.152: v29.53,11.75 30.48,12.7 v80.96,12.7 | v81.92,51.12 80.96,52.07 AND.13
N$70  (via drill 0.35)
  Top 0.152: AND.9 74.61,43.5 74.61,46.99 | 74.61,46.99 74.61,47.94 AND.12 | AND.4 66.99,48.58 66.99,53.02 67.63,53.66 | AND.1 67.63,53.66 | v33.34,62.55 NOT.12 | v65.41,62.55 67.63,60.33 67.63,53.66 | v73.98,46.99 74.61,46.99
  Bottom 0.152: v33.34,62.55 33.66,62.23 65.09,62.23 v65.41,62.55 | AND.4 v73.98,46.99
N$71  (via drill 0.35)
  Top 0.152: v66.04,28.26 69.53,31.75 69.53,38.1 70.17,38.73 70.17,42.55 69.22,43.5 66.67,43.5 v66.67,54.93
  Bottom 0.152: V4.1 53.66,28.26 v66.04,28.26 | v66.67,54.93 68.26,56.52 78.42,56.52 80.33,58.42 IC3.2
N$72  (via drill 0.35)
  Top 0.152: v85.09,53.98 v85.09,30.48
  Bottom 0.152: v85.09,30.48 V4.2 | v85.09,53.98 86.04,54.93 90.49,54.93 IC3.3
N$73  (via drill 0.35)
  Top 0.152: V4.4 58.1,35.56 v58.1,42.86
  Bottom 0.152: v58.1,42.86 58.74,43.5 78.11,43.5 78.74,44.13 90.49,44.13 IC3.8
N$74
  Bottom 0.152: V4.5 53.66,38.42 60.33,38.42 62.55,40.64 77.79,40.64 78.74,41.59 90.49,41.59 IC3.9
N$75  (via drill 0.35)
  Top 0.152: IC2.7 71.75,73.03 71.75,78.11 IC2.11 | v60.96,40.64 61.59,41.27 61.59,58.1 62.23,58.74 IC2.3 62.23,77.47 IC2.15
  Bottom 0.152: v60.96,40.64 V4.6 | IC2.11 68.26,78.42 61.28,78.42 IC2.15
N$77  (via drill 0.35)
  Top 0.152: IC5.13 26.35,34.61 v26.35,52.07 | v22.54,52.39 22.54,69.53 IC17.20
  Bottom 0.152: v26.35,52.07 26.04,52.39 v22.54,52.39
N$78
  Bottom 0.152: IC6.2 16.51,41.91 26.67,41.91 IC5.9
N$79  (via drill 0.35)
  Top 0.152: IC6.9 24.45,26.99 24.45,39.69 v25.08,40.32
  Bottom 0.152: v25.08,40.32 25.4,40.64 IC5.10
N$80  (via drill 0.35)
  Top 0.152: v25.08,37.78 v25.08,28.89
  Bottom 0.152: IC6.10 23.81,28.89 v25.08,28.89 | v25.08,37.78 25.4,38.1 IC5.11
N$81  (via drill 0.35)
  Top 0.152: IC6.1 16.83,41.59 16.83,37.15 v16.51,36.83
  Bottom 0.152: v16.51,36.83 26.67,36.83 IC5.12
N$82  (via drill 0.35)
  Top 0.152: IC6.11 21.27,32.07 21.27,38.1 | 21.27,38.1 21.27,39.05 IC6.15 | IC6.7 13.65,29.53 13.65,36.51 IC6.3 12.7,40.64 12.7,68.26 13.65,69.22 13.65,74.3 v9.84,78.11 | v20.64,38.1 21.27,38.1
  Bottom 0.152: IC17.8 9.53,78.11 v9.84,78.11 | IC6.3 v20.64,38.1
N$83  (via drill 0.35)
  Top 0.152: COMPARATOR.16 3.81,57.47 2.54,58.74 IC17.11 IC17.12 | 54.29,4.76 49.21,4.76 VOTEFORCAND3.1 48.9,4.45 48.58,4.76 | 54.29,4.76 54.29,8.57 54.93,9.21 S5.1 | 48.58,4.76 46.04,7.3 46.04,8.26 45.09,9.21 S6.1 44.77,9.53 44.13,10.16 44.13,20.95 43.81,21.27 43.81,27.94 V1.14 41.91,46.04 40.96,46.99 40.96,53.02 41.91,53.98 V6.5 41.59,56.2 41.59,60.96 41.27,61.28 38.1,61.28 V7.2 38.42,59.37 38.42,49.21 V6.9 | 54.29,4.76 54.29,2.22 56.83,2.22 59.05,4.45 VOTEFORCAND4.1 | IC23.8 2.54,12.7 J5.1 | IC23.4 8.89,3.81 8.89,12.7 J1.1 | S2.1 33.66,3.17 34.29,3.81 34.29,8.57 33.66,9.21 S7.1 | v12.38,32.7 12.38,19.68 14.92,17.14 14.92,13.65 | 14.92,13.65 14.92,12.7 J4.1 | 14.92,13.65 19.05,9.53 23.18,9.53 S8.1 23.5,9.21 24.13,8.57 24.13,3.81 v23.5,3.17 S1.1 v23.5,2.86 23.5,2.22 32.7,2.22 33.34,2.86 S2.1 | 48.58,4.76 46.04,2.22 33.66,2.22 33.66,2.86 S2.1 | IC16.14 97.47,5.4 97.47,36.51 IC3.11 IC3.12 | BUFFER.2 61.91,40.96 61.91,45.4 BUFFER.5 | v53.34,46.99 V4.7 | V6.12 47.31,48.58 47.31,53.66 V6.2 47.31,58.1 47.31,70.17 v47.62,70.48
  Bottom 0.152: IC1.5 78.42,70.17 63.5,70.17 63.18,70.48 63.18,73.98 | 63.18,73.98 65.72,73.98 IC2.5 | 47.94,73.98 6.67,73.98 IC17.12 | 47.94,73.98 63.18,73.98 | J5.1 2.54,12.7 3.81,13.97 7.3,13.97 8.57,12.7 J1.1 8.89,12.7 10.16,13.97 13.65,13.97 14.92,12.7 J4.1 | IC6.5 14.92,32.7 v12.38,32.7 | V4.7 54.61,41.91 BUFFER.12 | BUFFER.5 58.42,46.99 BUFFER.9 v53.34,46.99 53.02,46.67 48.9,46.67 47.31,48.26 V6.12 45.4,49.85 40.96,49.85 V6.9 | IC3.11 98.11,39.05 78.11,39.05 77.47,38.42 64.45,38.42 BUFFER.2 | 47.94,73.98 47.94,70.48 v47.62,70.48
N$84  (via drill 0.35)
  Top 0.152: IC9.10 83.82,19.37 | 83.82,19.37 IC9.7 | v41.59,51.75 41.91,51.44 V6.10 42.23,47.94 42.23,42.55 v42.55,42.23 | v83.5,19.37 83.82,19.37 | v47.31,41.59 v47.31,21.27
  Bottom 0.152: NOT.6 24.77,52.7 30.16,52.7 31.11,51.75 v41.59,51.75 | v83.5,19.37 83.19,19.68 67.31,19.68 66.67,19.05 49.53,19.05 v47.31,21.27 | v47.31,41.59 46.67,42.23 v42.55,42.23
N$85  (via drill 0.35)
  Top 0.152: v70.17,10.48 66.99,7.3 S9.3 66.67,6.99 66.04,6.35 66.04,5.71 62.87,5.71 S9.1 62.55,5.71 55.88,5.71 55.88,10.16 52.39,10.16 52.39,7.62 46.35,7.62 46.35,14.61 46.67,14.92 46.67,20.64 v45.09,22.23 45.72,22.86 V4.14 | DIS1.1 DIS1.8 DIS1.7 | IC12.10 52.7,73.03 v52.7,74.61 | v21.27,44.13 21.59,44.45 21.59,46.04 | 5.08,13.97 SV2.1 | 5.08,13.97 5.08,12.7 J5.2 | 5.08,13.97 6.99,15.88 | v6.67,42.23 6.99,41.91 6.99,21.91 | 6.99,15.88 6.99,21.91 | 6.99,15.88 SV2.3 | v27.3,74.61 27.3,53.98 25.72,52.39 25.72,50.16 21.59,46.04 | 21.59,46.04 COMPARATOR.8 | 6.99,21.91 v6.67,21.91
  Bottom 0.152: IC16.7 82.87,10.48 v70.17,10.48 | v45.09,22.23 28.57,22.23 V1.7 24.77,22.23 11.75,22.23 11.43,21.91 v6.67,21.91 | DIS1.7 95.57,78.42 98.11,78.42 98.11,75.25 97.47,74.61 v52.7,74.61 52.39,74.3 27.62,74.3 v27.3,74.61 | v21.27,44.13 11.11,44.13 IC11.10 9.21,42.23 v6.67,42.23 | IC23.1 3.81,3.81 6.67,3.81 | C1.2 6.67,3.81 | 6.67,11.43 10.16,11.43 11.43,12.7 J1.2 | 6.67,11.43 5.4,12.7 J5.2 | 6.67,11.43 6.67,3.81
N$86  (via drill 0.35)
  Top 0.152: DIS1.6 93.03,76.52 v93.03,54.29 | v89.22,52.39 89.53,52.07 89.53,13.02 89.85,12.7 89.85,9.53 84.77,4.45 84.77,2.54 84.14,1.91 18.1,1.91 18.1,6.99 16.51,8.57 16.51,9.53 13.65,12.38 13.65,15.24 13.97,15.56 13.97,17.46 13.02,18.41 10.16,18.41 SV2.4
  Bottom 0.152: v93.03,54.29 93.03,52.39 v89.22,52.39
N$87  (via drill 0.35)
  Top 0.152: DIS1.4 98.11,65.72 98.11,76.2 94.93,76.2 94.93,36.2 93.34,34.61 93.34,15.56 90.49,12.7 v90.49,8.57 | v14.29,10.79 13.02,12.06 13.02,16.19 SV2.5
  Bottom 0.152: v90.49,8.57 89.85,9.21 59.69,9.21 59.37,9.53 19.05,9.53 17.78,10.79 v14.29,10.79
N$88  (via drill 0.35)
  Top 0.152: IC5.1 33.34,32.7 33.34,41.59 | 33.34,41.59 33.34,56.83 NOT.11 | BUFFER.1 65.09,38.42 65.09,42.86 BUFFER.4 | BUFFER.13 57.47,40.96 57.47,45.4 BUFFER.10 | v33.97,41.59 33.34,41.59
  Bottom 0.152: IC3.20 97.16,59.05 97.16,41.91 78.42,41.91 77.47,40.96 62.23,40.96 61.91,40.64 | 61.91,40.64 60.64,39.37 BUFFER.13 44.77,39.37 42.55,41.59 v33.97,41.59 | BUFFER.4 62.87,43.81 58.1,43.81 57.47,43.18 57.47,41.27 61.28,41.27 61.91,40.64
N$89
  Bottom 0.152: DIS1.5 99.06,66.36 99.69,66.36 101.28,64.77 101.28,5.4 98.42,5.4 97.47,4.45 97.47,1.91 20.32,1.91 13.02,9.21 13.02,11.43 15.56,11.43 16.51,12.38 16.51,14.61 6.99,14.61 SV2.2
N$90  (via drill 0.35)
  Top 0.152: v87.63,8.26 87.31,8.57 87.31,13.65 86.36,14.61 IC9.8 | IC11.7 8.57,37.15 8.57,44.45 10.16,46.04 10.16,58.1 | 10.16,58.1 10.16,70.17 9.21,71.12 9.21,79.06 IC17.7 | AND.7 IC15.8 | v65.72,40.01 65.41,40.32 65.41,50.16 BUFFER.7 v63.5,57.47 | 89.85,47.31 IC3.7 | 89.85,47.31 89.85,53.66 IC8.8 | IC7.8 20.64,58.74 20.64,53.34 23.18,50.8 NOT.7 | IC12.7 44.13,72.07 44.13,58.1 v43.5,57.47 | v10.48,58.1 10.16,58.1 | COMPARATOR-2.8 89.85,18.1 89.85,47.31
  Bottom 0.152: IC9.8 87.31,16.19 91.12,16.19 COMPARATOR-2.8 | v87.63,8.26 87.31,8.57 69.22,8.57 68.9,8.89 59.37,8.89 59.05,9.21 18.41,9.21 18.1,8.89 J3.2 | v65.72,40.01 66.36,39.37 AND.7 | IC1.8 77.47,60.96 IC10.8 75.88,59.37 | 75.88,59.37 73.98,57.47 v63.5,57.47 v43.5,57.47 38.42,57.47 V6.7 36.2,56.52 33.34,56.52 32.38,57.47 30.16,57.47 28.26,59.37 21.91,59.37 IC7.8 20,58.1 v10.48,58.1 | IC8.8 89.22,57.47 92.71,57.47 93.03,57.78 93.03,59.37 75.88,59.37
N$91  (via drill 0.35)
  Top 0.152: IC11.16 4.76,32.7 4.76,66.36 IC7.16 | IC17.16 14.29,71.44 v14.29,69.53 | IC12.16 38.73,79.38 38.73,73.98 38.42,73.66 v38.42,69.22 | 51.75,36.83 BUFFER.14 | 51.75,36.83 51.75,47.94 V6.14 53.34,49.53 v53.34,67.31 | v51.44,8.57 51.75,8.89 51.75,36.83 | IC8.16 78.11,40.01 78.11,52.7 AND.14 | IC1.16 83.19,74.3 v83.19,56.52 | IC3.16 100.65,49.21 100.65,35.88 COMPARATOR-2.16
  Bottom 0.152: 13.65,68.9 v14.29,69.53 | 13.65,68.9 5.4,68.9 IC7.16 | 31.75,68.9 NOT.14 | 13.65,68.9 31.75,68.9 | IC10.16 57.15,68.58 53.34,68.58 | 53.34,68.58 51.75,68.58 51.44,68.9 38.42,68.9 | 31.75,68.9 38.42,68.9 | 38.42,68.9 v38.42,69.22 | v51.44,8.57 51.12,8.26 25.08,8.26 24.45,7.62 16.51,7.62 15.24,8.89 J3.1 | v83.19,56.52 81.28,54.61 AND.14 | IC9.16 68.58,25.08 84.77,25.08 IC15.16 87.31,27.62 92.39,27.62 97.79,33.02 | 97.79,33.02 COMPARATOR-2.16 | 97.79,33.02 93.66,37.15 80.96,37.15 IC8.16 57.15,38.1 BUFFER.14 | v53.34,67.31 53.34,68.58
N$92  (via drill 0.35)
  Top 0.152: JP2.1 21.27,20.64 21.27,26.04 v20.32,26.99 20,27.3 20,33.34 18.73,34.61 18.73,45.09 18.1,45.72 18.1,70.48 19.37,71.75 19.37,78.42 | IC3.4 89.22,55.56 89.22,79.38 88.9,79.69 75.88,79.69 v75.88,76.52 | v37.15,75.25 36.83,74.93 IC12.4 | v21.91,75.88 19.37,78.42 | 19.37,78.42 IC17.4
  Bottom 0.152: IC11.4 11.11,26.99 v20.32,26.99 | v75.88,76.52 75.56,76.2 57.47,76.2 57.15,76.52 55.24,76.52 54.29,75.56 37.47,75.56 v37.15,75.25 35.24,75.25 34.92,75.56 22.23,75.56 v21.91,75.88
N$93  (via drill 0.35)
  Top 0.152: 18.41,28.89 19.05,28.26 JP2.2 | 18.41,28.89 v17.78,29.53 | IC17.5 16.83,78.42 16.83,69.22 17.78,68.26 17.78,36.51 18.41,35.88 18.41,28.89 | 39.37,66.36 v41.59,64.14 | IC12.5 39.37,66.36 | v38.1,78.74 37.78,78.42 37.78,69.22 37.15,68.58 37.15,66.04 37.47,65.72 39.37,65.72 39.37,66.36
  Bottom 0.152: IC11.5 11.11,29.53 v17.78,29.53 | IC3.5 92.71,52.07 93.34,52.07 93.66,52.39 93.66,62.55 85.72,62.55 85.41,62.87 81.6,62.87 81.28,62.55 66.99,62.55 65.41,64.14 60.33,64.14 60.01,64.45 41.91,64.45 v41.59,64.14 | IC17.5 16.83,78.42 37.78,78.42 v38.1,78.74
N$95  (via drill 0.35)
  Top 0.152: JP2.4 13.02,21.27 v13.02,31.43 13.02,33.34 12.38,33.97 12.38,72.07 IC17.15 | IC3.15 97.47,49.85 v97.47,75.56
  Bottom 0.152: IC11.15 4.13,31.43 v13.02,31.43 | v97.47,75.56 95.25,77.79 44.13,77.79 42.23,79.69 | IC17.15 11.11,70.8 4.45,70.8 4.13,71.12 4.13,77.47 40.01,77.47 42.23,79.69 | 42.23,79.69 IC12.15
N$99  (via drill 0.35)
  Top 0.152: v16.19,31.75 16.83,31.11 16.83,20.64 JP2.3 | v39.37,78.11 41.91,75.56 IC12.6 42.23,72.07 42.23,58.42 42.86,57.78 42.86,53.66 43.18,53.34 | 43.18,53.34 v43.5,53.02 | v42.86,38.73 43.18,39.05 43.18,53.34
  Bottom 0.152: v16.19,31.75 15.88,32.07 11.11,32.07 IC11.6 8.57,34.61 8.57,39.05 37.15,39.05 37.47,38.73 v42.86,38.73 | IC17.6 14.61,78.11 v39.37,78.11 | IC3.6 89.85,49.85 84.45,49.85 81.92,52.39 78.11,52.39 77.47,53.02 v43.5,53.02

### Text on the board
Bottom: COOL BITS | COOL BITS | COOL BITS